# Altium schematic sheet 28Pins_Schematic.SchDoc (part 2 of 3)
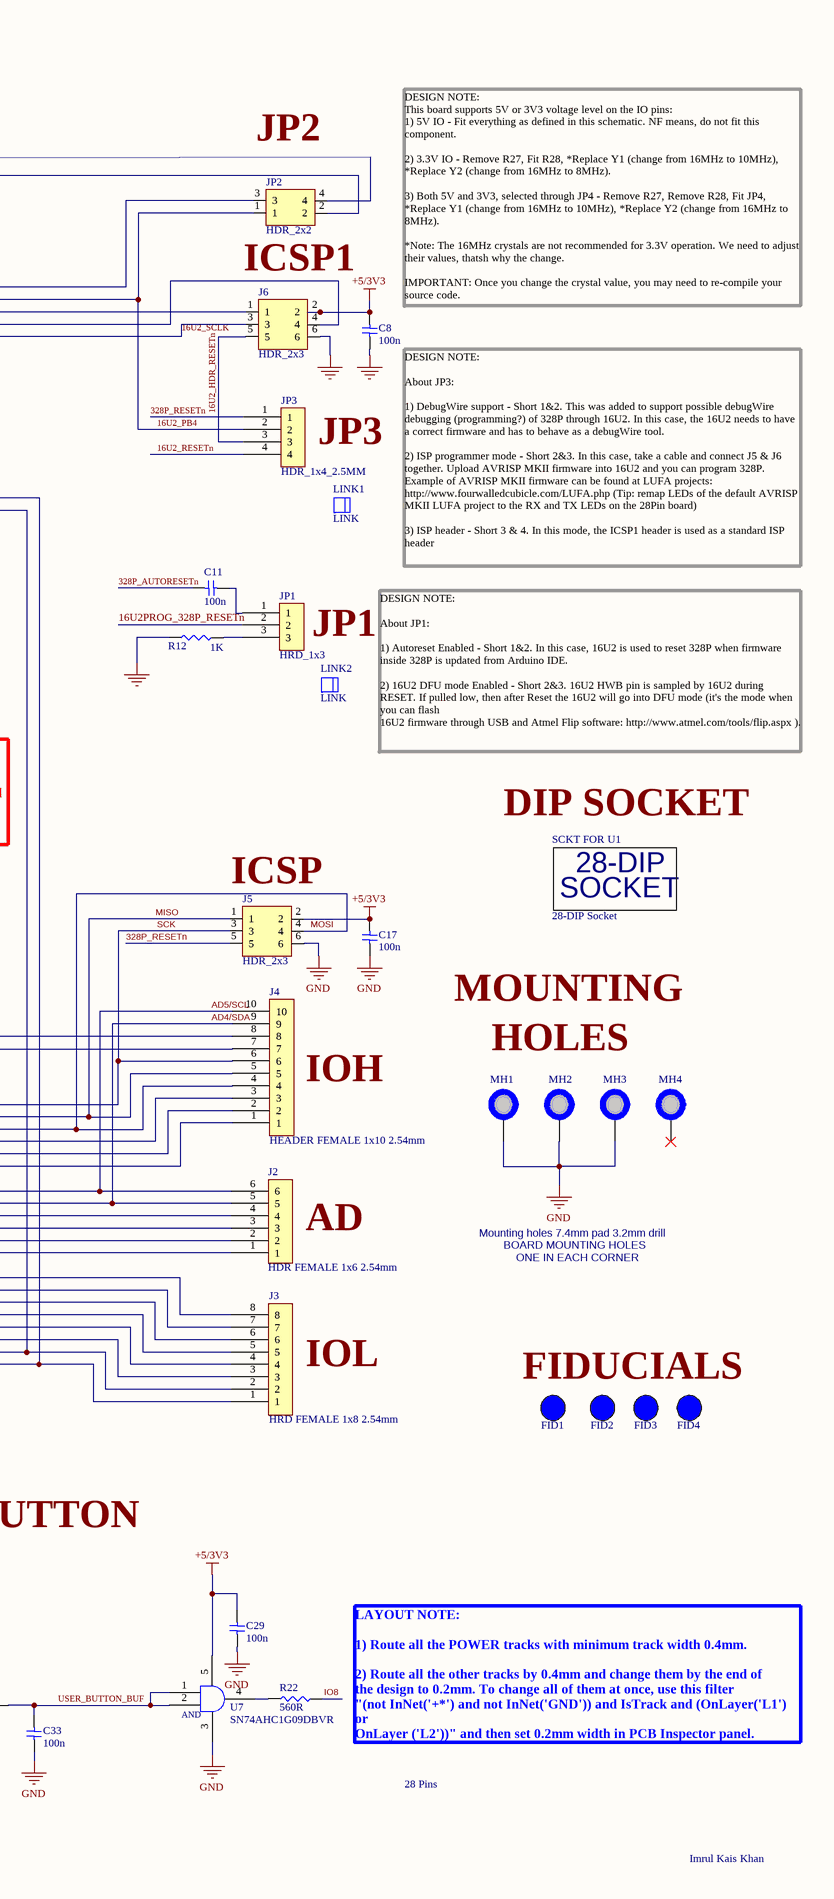
[diagram p2: 28Pins_Schematic.SchDoc, right]
## Library data of the parts
C1 C2 = EEE-1AA101WR: CAP ALUM 100UF 20% 10V SMD; Manufacturer: Panasonic; Ripple Current: 50mA; Life (Hours): 1000Hour; Supplier 1: Digi-Key; Manufacturer Part Number: EEE-1AA101WR; RoHS: Yes; Category: Aluminum Electrolytic Capacitors; Pricing 1: 1=0.42000, 10=0.29100, 50=0.20380, 100=0.17480, 500=0.13106 (USD); Mount: Surface Mount,PCB; Case/Package: Radial; Contact Plating: Tin; Min Operating Temperature: -40°C; Max Operating Temperature: 85°C; Capacitance: 100uF; Voltage Rating: 10V; Tolerance: 20%; Packaging: Tape and Reel; Package Quantity: 1000; Voltage Rating (DC): 10V; Termination: SMD/SMT; Ripple Current (AC): 50mA; Series: S; Construction: Cylindrical; Diameter: 5mm; Length: 5.5mm; Height: 5.4mm; Height - Seated (Max): 0.213inch; Ratings: AEC-Q200; Radiation Hardening: No; Lead Free: Lead Free; RoHS Compliant: Yes; ComponentLink1URL: https://datasheet.ciiva.com/26945/getdatasheetpartid-169213-26945071.pdf?src-supplier=Verical; ComponentLink1Description: https://datasheet.ciiva.com/26945/getdatasheetpartid-169213-26945071.pdf?src-supplier=Verical; ComponentLink2URL: https://datasheet.ciiva.com/24027/aba0000ce2-40801-24027541.pdf?src-supplier=Mouser; ComponentLink2Description: https://datasheet.ciiva.com/24027/aba0000ce2-40801-24027541.pdf?src-supplier=Mouser; ComponentLink3URL: https://datasheet.ciiva.com/14598/70255710-14598233.pdf?src-supplier=Allied+Electronics; ComponentLink3Description: https://datasheet.ciiva.com/14598/70255710-14598233.pdf?src-supplier=Allied+Electronics; ComponentLink4URL: https://datasheet.ciiva.com/14605/70255710-14605689.pdf?src-supplier=Allied+Electronics; ComponentLink4Description: https://datasheet.ciiva.com/14605/70255710-14605689.pdf?src-supplier=Allied+Electronics; ComponentLink5URL: https://datasheet.ciiva.com/11673/aba0000ce2-11673882.pdf?src-supplier=Avnet; ComponentLink5Description: https://datasheet.ciiva.com/11673/aba0000ce2-11673882.pdf?src-supplier=Avnet; ComponentLink6URL: https://datasheet.ciiva.com/16427/aba0000ce2-16427544.pdf?src-supplier=Future+Electronics; ComponentLink6Description: https://datasheet.ciiva.com/16427/aba0000ce2-16427544.pdf?src-supplier=Future+Electronics; ComponentLink7URL: https://datasheet.ciiva.com/2983/aba0000ce2-2983906.pdf?src-supplier=Avnet; ComponentLink7Description: https://datasheet.ciiva.com/2983/aba0000ce2-2983906.pdf?src-supplier=Avnet; ComponentLink8URL: https://datasheet.ciiva.com/30075/11aba0000ce2-30075303.pdf?src-supplier=Onlinecomponents.com; ComponentLink8Description: https://datasheet.ciiva.com/30075/11aba0000ce2-30075303.pdf?src-supplier=Onlinecomponents.com; Supplier Part Number 1: PCE3867CT-ND
C3 C12 C13 C19 C21 C22 C34 = C2012X5R1C106M085AC: TDK - C2012X5R1C106M085AC - SMD Multilayer Ceramic Capacitor, 10 µF, 16 V, 0805 [2012 Metric], ± 20%, X5R, C Series TDK; Capacitance: 10uF; Voltage Rating: 16V; Supplier 1: Arrow Electronics; Manufacturer: TDK; Manufacturer Part Number: C2012X5R1C106M085AC; RoHS: Yes; Category: Ceramic Capacitors; Stock 1: 888; Pricing 1: 1=0.26740, 10=0.11160, 25=0.11140, 50=0.10840, 100=0.08930, 250=0.08850, 500=0.05410 (USD); Mount: Surface Mount; Case/Package: 0805; Number of Pins: 2; Case Code (Metric): 2012; Case Code (Imperial): 0805; Weight: 0.000194oz; Dielectric Material: Ceramic; Min Operating Temperature: -55°C; Max Operating Temperature: 85°C; Packaging: Tape and Reel; Tolerance: 20%; Termination: SMD/SMT; Package Quantity: 4000; Voltage Rating (DC): 16V; Dielectric: X5R; Resistor Type: Ceramic; Series: C; Construction: Flat; Voltage: 16V; Length: 2mm; Width: 1.25mm; Height: 0.85mm; Thickness: 0.037inch; Depth: 1.25mm; RoHS Compliant: Yes; Lead Free: Lead Free; ComponentLink1URL: https://datasheet.ciiva.com/11788/0900766b80c1bb00-11788108.pdf?src-supplier=Rs; ComponentLink1Description: https://datasheet.ciiva.com/11788/0900766b80c1bb00-11788108.pdf?src-supplier=Rs; ComponentLink2URL: https://datasheet.ciiva.com/24218/c2012x5r1c106m085ac-265002-24218340.pdf?src-supplier=Mouser; ComponentLink2Description: https://datasheet.ciiva.com/24218/c2012x5r1c106m085ac-265002-24218340.pdf?src-supplier=Mouser; ComponentLink3URL: https://datasheet.ciiva.com/6290/tdkmlcccaprange-6290485.pdf?src-supplier=Digi-Key; ComponentLink3Description: https://datasheet.ciiva.com/6290/tdkmlcccaprange-6290485.pdf?src-supplier=Digi-Key; ComponentLink4URL: https://datasheet.ciiva.com/22725/1913358-22725557.pdf?src-supplier=Element14; ComponentLink4Description: https://datasheet.ciiva.com/22725/1913358-22725557.pdf?src-supplier=Element14; ComponentLink5URL: https://datasheet.ciiva.com/6290/tdkmlcccaprange-6290487.pdf?src-supplier=Digi-Key; ComponentLink5Description: https://datasheet.ciiva.com/6290/tdkmlcccaprange-6290487.pdf?src-supplier=Digi-Key; ComponentLink6URL: https://datasheet.ciiva.com/16449/e412-c-16449591.pdf?src-supplier=Future+Electronics; ComponentLink6Description: https://datasheet.ciiva.com/16449/e412-c-16449591.pdf?src-supplier=Future+Electronics; ComponentLink7URL: https://datasheet.ciiva.com/23803/1796654-23803021.pdf?src-supplier=Newark; ComponentLink7Description: https://datasheet.ciiva.com/23803/1796654-23803021.pdf?src-supplier=Newark; Supplier Part Number 1: C2012X5R1C106M085AC
C4-C6 C8 C11 C14-C17 C20 C23 C24 C26 C28-C33 = C2012X7R1H104K085AA (2): C Series 0805 0.1 uF 50 V ±10 % Tolerance X7R SMT Multilayer Ceramic Capacitor; Manufacturer: TDK; Capacitance: 100nF; Voltage Rating: 50V; Tolerance: 10%; Supplier 1: Digi-Key; RoHS: Yes; Category: Ceramic Capacitors; Stock 1: 1523417; Pricing 1: 1=0.13000, 10=0.09500, 50=0.05400, 100=0.04480, 500=0.03142, 1000=0.02601 (USD); Mount: Surface Mount; Case/Package: 0805; Number of Pins: 2; Case Code (Metric): 2012; Case Code (Imperial): 0805; Weight: 0.000194oz; Dielectric Material: Ceramic; Min Operating Temperature: -55°C; Max Operating Temperature: 125°C; Packaging: Tape and Reel; Voltage Rating (DC): 50V; Dielectric: X7R; Termination: SMD/SMT; Construction: Flat; Package Quantity: 1; Resistor Type: Ceramic; Voltage: 50V; Series: C; Length: 2mm; Width: 0.049inch; Height: 0.85mm; Depth: 1.25mm; Thickness: 0.037inch; Radiation Hardening: No; RoHS Compliant: Yes; Reach SVHC Compliant: Yes; Lead Free: Lead Free; ComponentLink1URL: https://datasheet.ciiva.com/11788/0900766b80c1bb00-11788128.pdf?src-supplier=Rs; ComponentLink1Description: https://datasheet.ciiva.com/11788/0900766b80c1bb00-11788128.pdf?src-supplier=Rs; ComponentLink2URL: https://datasheet.ciiva.com/6250/tdkmlcccaprange-6250821.pdf?src-supplier=Digi-Key; ComponentLink2Description: https://datasheet.ciiva.com/6250/tdkmlcccaprange-6250821.pdf?src-supplier=Digi-Key; ComponentLink3URL: https://datasheet.ciiva.com/24191/e412-c-24191447.pdf?src-supplier=Future+Electronics; ComponentLink3Description: https://datasheet.ciiva.com/24191/e412-c-24191447.pdf?src-supplier=Future+Electronics; ComponentLink4URL: https://datasheet.ciiva.com/6250/tdkmlcccaprange-6250824.pdf?src-supplier=Digi-Key; ComponentLink4Description: https://datasheet.ciiva.com/6250/tdkmlcccaprange-6250824.pdf?src-supplier=Digi-Key; ComponentLink5URL: https://datasheet.ciiva.com/23803/1796654-23803035.pdf?src-supplier=Newark; ComponentLink5Description: https://datasheet.ciiva.com/23803/1796654-23803035.pdf?src-supplier=Newark; ComponentLink6URL: https://datasheet.ciiva.com/28602/1571323-28602204.pdf?src-supplier=Element14; ComponentLink6Description: https://datasheet.ciiva.com/28602/1571323-28602204.pdf?src-supplier=Element14; Manufacturer Part Number: C2012X7R1H104K085AA; Supplier Part Number 1: 445-7534-1-ND
C7 = C2012X5R1E105K125AA: CAP CER 1UF 25V X5R 0805; Manufacturer: TDK; Dielectric Material: Ceramic; Tolerance: 10%; Supplier 1: Digi-Key; Manufacturer Part Number: C2012X5R1E105K125AA; RoHS: Yes; Category: Ceramic Capacitors; Stock 1: 51550; Pricing 1: 1=0.21000, 10=0.14500, 50=0.08720, 100=0.07370, 500=0.05042, 1000=0.04460 (USD); Mount: Surface Mount; Case/Package: 0805; Number of Pins: 2; Case Code (Metric): 2012; Case Code (Imperial): 0805; Weight: 0.000194oz; Min Operating Temperature: -55°C; Max Operating Temperature: 85°C; Capacitance: 1uF; Voltage Rating: 25V; Packaging: Tape and Reel; Voltage Rating (DC): 25V; Dielectric: X5R; Termination: SMD/SMT; Construction: Flat; Package Quantity: 2000; Resistor Type: Ceramic; Voltage: 25V; Series: C; Length: 2mm; Width: 0.049inch; Height: 1.25mm; Depth: 1.25mm; Thickness: 0.057inch; Radiation Hardening: No; Lead Free: Lead Free; RoHS Compliant: Yes; Reach SVHC Compliant: Yes; ComponentLink1URL: https://datasheet.ciiva.com/11787/0900766b80c1bb00-11787608.pdf?src-supplier=Rs; ComponentLink1Description: https://datasheet.ciiva.com/11787/0900766b80c1bb00-11787608.pdf?src-supplier=Rs; ComponentLink2URL: https://datasheet.ciiva.com/16449/e412-c-16449595.pdf?src-supplier=Future+Electronics; ComponentLink2Description: https://datasheet.ciiva.com/16449/e412-c-16449595.pdf?src-supplier=Future+Electronics; ComponentLink3URL: https://datasheet.ciiva.com/28602/1744655-28602171.pdf?src-supplier=Element14; ComponentLink3Description: https://datasheet.ciiva.com/28602/1744655-28602171.pdf?src-supplier=Element14; ComponentLink4URL: https://datasheet.ciiva.com/15192/getdatasheetpartid-726707-15192140.pdf?src-supplier=Verical; ComponentLink4Description: https://datasheet.ciiva.com/15192/getdatasheetpartid-726707-15192140.pdf?src-supplier=Verical; Supplier Part Number 1: 445-1419-1-ND
C9 C10 C25 C27 = C0805C180J5GACTU: Cap Ceramic 18pF 50V C0G 5% SMD 0805 125C Paper T/R; Manufacturer: KEMET; Temperature Coefficient: 30ppm/°C; Dissipation Factor: 0.1%; Supplier 1: Digi-Key; Manufacturer Part Number: C0805C180J5GACTU; RoHS: Yes; Category: Ceramic Capacitors; Stock 1: 36847; Pricing 1: 1=0.11000, 10=0.07900, 50=0.04500, 100=0.03730, 500=0.02618, 1000=0.02168 (USD); Mount: Surface Mount,PCB; Case/Package: 0805; Number of Pins: 2; Dielectric Material: Ceramic; Case Code (Imperial): 0805; Case Code (Metric): 2012; Contact Plating: Tin,Matte; Contact Material: Tin; Min Operating Temperature: -55°C; Max Operating Temperature: 125°C; Tolerance: 5%; Capacitance: 18pF; Dielectric: C0G; Packaging: Tape and Reel; Termination: SMD/SMT; Voltage Rating (DC): 50V; Package Quantity: 1; Series: C; Construction: Flat; Voltage: 50V; Voltage Rating: 50V; Length: 2mm; Width: 0.049inch; Height: 0.78mm; Depth: 1.25mm; Lead Pitch: 0.75mm; Thickness: 0.035inch; Radiation Hardening: No; Lead Free: Lead Free; RoHS Compliant: Yes; Reach SVHC Compliant: Yes; ComponentLink1URL: https://datasheet.ciiva.com/22746/1769375-22746770.pdf?src-supplier=Element14; ComponentLink1Description: https://datasheet.ciiva.com/22746/1769375-22746770.pdf?src-supplier=Element14; ComponentLink2URL: https://datasheet.ciiva.com/26923/getdatasheetpartid-759702-26923980.pdf?src-supplier=Verical; ComponentLink2Description: https://datasheet.ciiva.com/26923/getdatasheetpartid-759702-26923980.pdf?src-supplier=Verical; ComponentLink3URL: https://datasheet.ciiva.com/26847/getdatasheetpartid-385668-26847862.pdf?src-supplier=Verical; ComponentLink3Description: https://datasheet.ciiva.com/26847/getdatasheetpartid-385668-26847862.pdf?src-supplier=Verical; Supplier Part Number 1: 399-C0805C180J5GAC7800CT-ND
D1 = LGL29K-G2J1-24-Z: LED Single Chip Green 570nm 20mA 2-Pin 0603 T/R; Manufacturer: Osram Opto; Lens Color: White; Forward Voltage: 2.2V; Luminous Intensity: 5.6mcd; Viewing Angle: 160°; Lens Style: Flat,Diffused,Colorless,Rectangular; Test Current: 2mA; Luminous Flux: 0.012lm; Number of LEDs: 1; Reverse Voltage: 12V; Lens Transparency: Diffused; Lens Size: 0.8mm; Supplier 1: SHENGYU ELECTRONICS; Manufacturer Part Number: LGL29K-G2J1-24-Z; RoHS: Yes; Category: LEDs; Stock 1: 8400; Pricing 1: 5=0.07900, 10=0.07800, 100=0.08000, 1000=0.07000, 10000=0.07000 (USD); Mount: Surface Mount; Case/Package: 0603; Number of Pins: 2; Color: Green; Case Code (Metric): 1608; Case Code (Imperial): 0603; Min Operating Temperature: -40°C; Max Operating Temperature: 100°C; Packaging: Tape and Reel; Series: SmartLED; Forward Current: 20mA; Package Quantity: 5000; Dominant Wavelength: 570nm; Number of Elements: 1; Illumination Color: Green; Length: 1.3mm; Width: 0.8mm; Height: 0.65mm; Depth: 0.8mm; Radiation Hardening: No; RoHS Compliant: Yes; ComponentLink1URL: https://datasheet.ciiva.com/4689/g-l29k-39844-4689584.pdf?src-supplier=Mouser; ComponentLink1Description: https://datasheet.ciiva.com/4689/g-l29k-39844-4689584.pdf?src-supplier=Mouser; ComponentLink2URL: https://datasheet.ciiva.com/15198/getdatasheetpartid-571127-15198411.pdf?src-supplier=Verical; ComponentLink2Description: https://datasheet.ciiva.com/15198/getdatasheetpartid-571127-15198411.pdf?src-supplier=Verical; ComponentLink3URL: https://datasheet.ciiva.com/2112/00077107-0-2112887.pdf?src-supplier=Digi-Key; ComponentLink3Description: https://datasheet.ciiva.com/2112/00077107-0-2112887.pdf?src-supplier=Digi-Key; ComponentLink4URL: https://datasheet.ciiva.com/2112/00077107-0-2112886.pdf?src-supplier=Digi-Key; ComponentLink4Description: https://datasheet.ciiva.com/2112/00077107-0-2112886.pdf?src-supplier=Digi-Key; ComponentLink5URL: https://datasheet.ciiva.com/2112/00077107-0-2112888.pdf?src-supplier=Digi-Key; ComponentLink5Description: https://datasheet.ciiva.com/2112/00077107-0-2112888.pdf?src-supplier=Digi-Key; Supplier Part Number 1: LGL29K-G2J1-24-Z
D2-D4 = LOL29K-H2K1-24: LED Uni-Color Orange 610nm 2-Pin Case 0603 T/R; Manufacturer: Osram Opto; Lens Color: Clear; Luminous Intensity: 9mcd; Forward Voltage: 2.2V; Forward Current: 20mA; Viewing Angle: 160°; Lens Style: Diffused,Colorless; Luminous Flux: 0.025lm; Dominant Wavelength: 606nm; Test Current: 2mA; Number of Elements: 1; Reverse Voltage: 12V; Supplier 1: Mouser; Manufacturer Part Number: LOL29K-H2K1-24; RoHS: Yes; Category: LEDs; Stock 1: 21307; Pricing 1: 1=0.46000, 10=0.31000, 50=0.31000, 100=0.20700, 1000=0.12000, 10000=0.09200 (USD); Mount: Surface Mount; Case/Package: 1608; Number of Pins: 2; Color: Orange; Min Operating Temperature: -40°C; Max Operating Temperature: 100°C; Packaging: Tape and Reel; Number of LEDs: 1; Series: SmartLED; Length: 1.3mm; Depth: 0.8mm; RoHS Compliant: Yes; ComponentLink1URL: https://datasheet.ciiva.com/11775/0900766b80d1573e-11775188.pdf?src-supplier=Rs; ComponentLink1Description: https://datasheet.ciiva.com/11775/0900766b80d1573e-11775188.pdf?src-supplier=Rs; Supplier Part Number 1: 720-LOL29KH2K124Z
D5 D6 = BAT54HT1G: VR=30V IF=200mA 10pF P=200mW; Manufacturer: ON Semiconductor / Fairchild; Forward Voltage: 800mV; Forward Current: 200mA; Recovery Time: 5ns; Max Repetitive Reverse Voltage (Vrrm): 30V; Peak Non-Repetitive Surge Current: 600mA; Element Configuration: Single; Max Reverse Current: 2uA; Power Dissipation: 200mW; Polarity: Standard; Supplier 1: Digi-Key; Manufacturer Part Number: BAT54HT1G; RoHS: Yes; Category: Schottky Diodes; Stock 1: 64443; Pricing 1: 1=0.24000, 10=0.19900, 100=0.10570, 500=0.06956, 1000=0.04730 (USD); Mount: Surface Mount; Number of Pins: 2; Contact Plating: Tin,Matte; Min Operating Temperature: -55°C; Max Operating Temperature: 150°C; Packaging: Tape and Reel; Package Quantity: 1; Average Rectified Current: 200mA; Reverse Recovery Time: 5ns; Max Forward Surge Current (Ifsm): 600mA; Max Reverse Voltage (DC): 30V; Series: -; Max Surge Current: 600mA; Voltage Rating (DC): 30V; Current Rating: 200mA; Capacitance: 10pF; Output Current: 200mA; Reverse Voltage: 30V; Max Reverse Leakage Current: 2uA; Reverse Recovery Time-Max: 5ns; Length: 1.8mm; Width: 1.35mm; Height: 1mm; Radiation Hardening: No; Lead Free: Lead Free; RoHS Compliant: Yes; Reach SVHC Compliant: Yes; ComponentLink1URL: https://datasheet.ciiva.com/30479/0900766b811a63a9-30479442.pdf?src-supplier=Rs; ComponentLink1Description: https://datasheet.ciiva.com/30479/0900766b811a63a9-30479442.pdf?src-supplier=Rs; ComponentLink2URL: https://datasheet.ciiva.com/1240/1747983-1240762.pdf?src-supplier=Newark; ComponentLink2Description: https://datasheet.ciiva.com/1240/1747983-1240762.pdf?src-supplier=Newark; ComponentLink3URL: https://datasheet.ciiva.com/34301/806549-34301562.pdf?src-supplier=Jameco; ComponentLink3Description: https://datasheet.ciiva.com/34301/806549-34301562.pdf?src-supplier=Jameco; ComponentLink4URL: https://datasheet.ciiva.com/4452/bat54ht1g-104602-4452889.pdf?src-supplier=Mouser; ComponentLink4Description: https://datasheet.ciiva.com/4452/bat54ht1g-104602-4452889.pdf?src-supplier=Mouser; ComponentLink5URL: https://datasheet.ciiva.com/4714/bat54ht1-d-72881-4714706.pdf?src-supplier=Mouser; ComponentLink5Description: https://datasheet.ciiva.com/4714/bat54ht1-d-72881-4714706.pdf?src-supplier=Mouser; ComponentLink6URL: https://datasheet.ciiva.com/1180/bat54ht1-d-1180252.pdf?src-supplier=Element14; ComponentLink6Description: https://datasheet.ciiva.com/1180/bat54ht1-d-1180252.pdf?src-supplier=Element14; ComponentLink7URL: https://datasheet.ciiva.com/1180/bat54ht1-d-1180251.pdf?src-supplier=Element14; ComponentLink7Description: https://datasheet.ciiva.com/1180/bat54ht1-d-1180251.pdf?src-supplier=Element14; ComponentLink8URL: https://datasheet.ciiva.com/915/bat54ht1-d-915443.pdf?src-supplier=Digi-Key; ComponentLink8Description: https://datasheet.ciiva.com/915/bat54ht1-d-915443.pdf?src-supplier=Digi-Key; ComponentLink9URL: https://datasheet.ciiva.com/8303/bat54ht1g-8303645.pdf?src-supplier=Avnet; ComponentLink9Description: https://datasheet.ciiva.com/8303/bat54ht1g-8303645.pdf?src-supplier=Avnet; ComponentLink10URL: https://datasheet.ciiva.com/17020/bat54ht1g-17020445.pdf?src-supplier=Future+Electronics; ComponentLink10Description: https://datasheet.ciiva.com/17020/bat54ht1g-17020445.pdf?src-supplier=Future+Electronics; ComponentLink11URL: https://datasheet.ciiva.com/8294/bat54ht1-d-8294645.pdf?src-supplier=Avnet; ComponentLink11Description: https://datasheet.ciiva.com/8294/bat54ht1-d-8294645.pdf?src-supplier=Avnet; ComponentLink12URL: https://datasheet.ciiva.com/910/bat54ht1g-910498.pdf?src-supplier=Digi-Key; ComponentLink12Description: https://datasheet.ciiva.com/910/bat54ht1g-910498.pdf?src-supplier=Digi-Key; ComponentLink13URL: https://datasheet.ciiva.com/910/bat54ht1g-910499.pdf?src-supplier=Digi-Key; ComponentLink13Description: https://datasheet.ciiva.com/910/bat54ht1g-910499.pdf?src-supplier=Digi-Key; ComponentLink14URL: https://datasheet.ciiva.com/915/bat54ht1-d-915444.pdf?src-supplier=Digi-Key; ComponentLink14Description: https://datasheet.ciiva.com/915/bat54ht1-d-915444.pdf?src-supplier=Digi-Key; ComponentLink15URL: https://datasheet.ciiva.com/915/bat54ht1-d-915445.pdf?src-supplier=Digi-Key; ComponentLink15Description: https://datasheet.ciiva.com/915/bat54ht1-d-915445.pdf?src-supplier=Digi-Key; ComponentLink16URL: https://datasheet.ciiva.com/46429/1727620-46429206.pdf?src-supplier=Element14; ComponentLink16Description: https://datasheet.ciiva.com/46429/1727620-46429206.pdf?src-supplier=Element14; ComponentLink17URL: https://datasheet.ciiva.com/910/bat54ht1g-910497.pdf?src-supplier=Digi-Key; ComponentLink17Description: https://datasheet.ciiva.com/910/bat54ht1g-910497.pdf?src-supplier=Digi-Key; ComponentLink18URL: https://datasheet.ciiva.com/48686/001262925-da-01-en-diode-schottky-30v-bat54ht1g-sod-323-fsc-48686266.pdf?src-supplier=Conrad; ComponentLink18Description: https://datasheet.ciiva.com/48686/001262925-da-01-en-diode-schottky-30v-bat54ht1g-sod-323-fsc-48686266.pdf?src-supplier=Conrad; Supplier Part Number 1: BAT54HT1GOSCT-ND
FB1-FB3 = MPZ2012S601AT000: 0805 600Ω ±25% DCR=0.1Ω 2A; Manufacturer: TDK; Impedance: 600R; DC Resistance (DCR): 100mR; Number of Lines: 1; Supplier 1: Newark; Manufacturer Part Number: MPZ2012S601AT000; RoHS: Yes; Category: Ferrite Beads and Chips; Stock 1: 12934; Pricing 1: 1=0.13000, 25=0.10100, 50=0.07400, 100=0.04600 (USD); Mount: Surface Mount; Case/Package: 0805; Case Code (Metric): 2012; Case Code (Imperial): 0805; Min Operating Temperature: -55°C; Max Operating Temperature: 125°C; Packaging: Tape and Reel; Package Quantity: 1; Current Rating: 2A; Max DC Current: 2A; Series: MPZ; Max Current Rating: 2A; Length: 0.079inch; Width: 0.049inch; Height: 0.041inch; Reach SVHC Compliant: Yes; Lead Free: Lead Free; RoHS Compliant: Yes; ComponentLink1URL: https://datasheet.ciiva.com/46634/beads-commercial-power-mpz-en-46634335.pdf?src-supplier=Digi-Key; ComponentLink1Description: https://datasheet.ciiva.com/46634/beads-commercial-power-mpz-en-46634335.pdf?src-supplier=Digi-Key; ComponentLink2URL: https://datasheet.ciiva.com/46634/beads-commercial-power-mpz-en-46634377.pdf?src-supplier=Digi-Key; ComponentLink2Description: https://datasheet.ciiva.com/46634/beads-commercial-power-mpz-en-46634377.pdf?src-supplier=Digi-Key; ComponentLink3URL: https://datasheet.ciiva.com/46634/beads-commercial-power-mpz-en-46634606.pdf?src-supplier=Digi-Key; ComponentLink3Description: https://datasheet.ciiva.com/46634/beads-commercial-power-mpz-en-46634606.pdf?src-supplier=Digi-Key; Supplier Part Number 1: 89R3160
FID1-FID4 = FID_1MMC: Fiducial 40mil Diameter, 120mil Mask
J1 J3 = M20-7820842: 2.54mm (0.1") Pitch SIL Vertical PC Tail Socket Assembly, selective gold + tin, 8 contacts; Manufacturer: Harwin; Number of Contacts: 8; Connector Type: Receptacle,Socket; Max Current Rating: 3A; Contact Resistance: 20mR; Supplier 1: Digi-Key; Manufacturer Part Number: M20-7820842; RoHS: Yes; Category: Headers and Wire Housings; Stock 1: 1355; Pricing 1: 1=1.10000, 10=0.97200, 100=0.83820, 500=0.68580, 1000=0.60960, 5000=0.53340, 10000=0.50673 (USD); Mount: Through Hole; Case/Package: SIL; Weight: 0.025397oz; Contact Plating: Tin,Gold; Housing Color: Black; Color: Black; Contact Material: Bronze; Housing Material: Polyamide; Min Operating Temperature: -40°C; Max Operating Temperature: 105°C; Termination: Solder; Number of Rows: 1; Orientation: Straight; Number of Positions: 8; Gender: Female; Contact Gender: Female; Package Quantity: 29; Packaging: Rail/Tube; Length: 20.72mm; Pitch: 2.54mm; Depth: 2.5mm; Radiation Hardening: No; ComponentLink1URL: https://datasheet.ciiva.com/16732/m20-782-16732663.pdf?src-supplier=Avnet+Europe; ComponentLink1Description: https://datasheet.ciiva.com/16732/m20-782-16732663.pdf?src-supplier=Avnet+Europe; ComponentLink2URL: https://datasheet.ciiva.com/9480/m20-782-9480074.pdf?src-supplier=Avnet; ComponentLink2Description: https://datasheet.ciiva.com/9480/m20-782-9480074.pdf?src-supplier=Avnet; Supplier Part Number 1: 952-1823-ND
J2 = M20-7820646: 06-WAY SIL VERT SOCKET L/FREE; Manufacturer: Harwin; Number of Contacts: 6; Connector Type: Receptacle,Socket; Max Current Rating: 3A; Contact Resistance: 20mR; Supplier 1: Digi-Key; Manufacturer Part Number: M20-7820646; RoHS: Yes; Category: Headers and Wire Housings; Stock 1: 2220; Pricing 1: 1=0.96000, 10=0.84200, 100=0.72600, 500=0.59400, 1000=0.52800, 5000=0.46200, 10000=0.43890 (USD); Mount: Through Hole; Case/Package: SIL; Housing Material: Nylon; Color: Black; Contact Plating: Tin; Contact Material: Bronze; Housing Color: Black; Min Operating Temperature: -40°C; Max Operating Temperature: 105°C; Termination: Solder; Number of Rows: 1; Gender: Female; Number of Positions: 6; Packaging: Rail/Tube; Orientation: Straight; Contact Gender: Female; Package Quantity: 38; Length: 15.64mm; Pitch: 2.54mm; Depth: 2.5mm; Radiation Hardening: No; ComponentLink1URL: http://components.arrow.com/part/dataview/0323_00725884?src-supplier=Arrow+Europe; ComponentLink1Description: http://components.arrow.com/part/dataview/0323_00725884?src-supplier=Arrow+Europe; ComponentLink2URL: http://www.harwin.com/include/downloads/pdfs/2010PAGE120.PDF?src-supplier=Avnet; ComponentLink2Description: http://www.harwin.com/include/downloads/pdfs/2010PAGE120.PDF?src-supplier=Avnet; ComponentLink3URL: https://cdn.harwin.com/pdfs/M20-782.pdf?src-supplier=Digi-Key; ComponentLink3Description: https://cdn.harwin.com/pdfs/M20-782.pdf?src-supplier=Digi-Key; ComponentLink4URL: https://cdn.harwin.com/pdfs/Harwin_PC_Connectors_M20.pdf?src-supplier=Avnet+Europe; ComponentLink4Description: https://cdn.harwin.com/pdfs/Harwin_PC_Connectors_M20.pdf?src-supplier=Avnet+Europe; ComponentLink5URL: https://cdn.harwin.com/pdfs/Harwin_PC_Connectors_M20.pdf?src-supplier=RSComponents; ComponentLink5Description: https://cdn.harwin.com/pdfs/Harwin_PC_Connectors_M20.pdf?src-supplier=RSComponents; ComponentLink6URL: https://cdn.harwin.com/pdfs/Harwin_PC_Connectors_M20.pdf?src-supplier=Mouser; ComponentLink6Description: https://cdn.harwin.com/pdfs/Harwin_PC_Connectors_M20.pdf?src-supplier=Mouser; ComponentLink7URL: https://cdn.harwin.com/pdfs/Harwin_PC_Connectors_M20.pdf?src-supplier=TTI; ComponentLink7Description: https://cdn.harwin.com/pdfs/Harwin_PC_Connectors_M20.pdf?src-supplier=TTI; Supplier Part Number 1: 952-1809-ND
J4 = M20-7821046: HARWIN - M20-7821046 - Board-To-Board Connector, M20 Series, Through Hole, Receptacle, 10, 2.54 mm, Tin Plated Contacts; Connector Type: Receptacle,Socket; Number of Positions: 10; Insulation Resistance: 1MR; Max Current Rating: 3A; Contact Resistance: 20mR; Mating Cycles: 50; Hole Diameter: 0.8mm; Supplier 1: Digi-Key; Manufacturer: Harwin; Manufacturer Part Number: M20-7821046; RoHS: Yes; Category: Headers and Wire Housings; Stock 1: 530; Pricing 1: 1=1.28000, 10=1.12200, 100=0.96800, 500=0.79200, 1000=0.70400, 5000=0.61600, 10000=0.58520 (USD); Mount: Through Hole; Case/Package: SIL; Housing Color: Black; Color: Black; Contact Plating: Tin; Contact Material: Bronze; Housing Material: Polyamide; Min Operating Temperature: -40°C; Max Operating Temperature: 105°C; Orientation: Straight; Termination: Solder; Number of Contacts: 10; Gender: Receptacle; Packaging: Rail/Tube; Number of Rows: 1; Contact Gender: Female; Package Quantity: 23; Current Rating: 3A; Length: 25.8mm; Pitch: 2.54mm; Depth: 2.5mm; Lead Pitch: 2.54mm; Radiation Hardening: No; REACH SVHC: No SVHC; ComponentLink1URL: https://datasheet.ciiva.com/26899/getdatasheetpartid-559226-26899379.pdf?src-supplier=Verical; ComponentLink1Description: https://datasheet.ciiva.com/26899/getdatasheetpartid-559226-26899379.pdf?src-supplier=Verical; ComponentLink2URL: https://datasheet.ciiva.com/11753/0900766b80dc1d2b-11753869.pdf?src-supplier=RSComponents; ComponentLink2Description: https://datasheet.ciiva.com/11753/0900766b80dc1d2b-11753869.pdf?src-supplier=RSComponents; ComponentLink3URL: https://datasheet.ciiva.com/6785/m20-782-6785605.pdf?src-supplier=Digi-Key; ComponentLink3Description: https://datasheet.ciiva.com/6785/m20-782-6785605.pdf?src-supplier=Digi-Key; ComponentLink4URL: https://datasheet.ciiva.com/10151/m20-782-10151366.pdf?src-supplier=Avnet; ComponentLink4Description: https://datasheet.ciiva.com/10151/m20-782-10151366.pdf?src-supplier=Avnet; ComponentLink5URL: https://datasheet.ciiva.com/16732/m20-782-16732152.pdf?src-supplier=Avnet+Europe; ComponentLink5Description: https://datasheet.ciiva.com/16732/m20-782-16732152.pdf?src-supplier=Avnet+Europe; Supplier Part Number 1: 952-1847-ND
J5 J6 = 67997-106HLF: Conn Unshrouded Header HDR 6 POS 2.54mm Solder ST Top Entry Thru-Hole BergStik® Bulk; Manufacturer: Amphenol ICC / FCI; Supplier 1: Mouser; Manufacturer Part Number: 67997-106HLF; RoHS: No; Category: Headers and Wire Housings; Stock 1: 1180; Pricing 1: 1=2.25000, 10=2.14000, 50=2.14000, 100=1.98000, 1000=1.41000, 10000=1.20000 (USD); ComponentLink1URL: http://uk.rs-online.com/webdocs/1450/0900766b81450b8b.pdf?src-supplier=Rs; ComponentLink1Description: http://uk.rs-online.com/webdocs/1450/0900766b81450b8b.pdf?src-supplier=Rs; ComponentLink2URL: https://cdn.amphenol-icc.com/media/wysiwyg/files/drawing/67996.pdf?src-supplier=Onlinecomponents.com; ComponentLink2Description: https://cdn.amphenol-icc.com/media/wysiwyg/files/drawing/67996.pdf?src-supplier=Onlinecomponents.com; ComponentLink3URL: https://cdn.amphenol-icc.com/media/wysiwyg/files/drawing/67996.pdf?src-supplier=Digi-Key; ComponentLink3Description: https://cdn.amphenol-icc.com/media/wysiwyg/files/drawing/67996.pdf?src-supplier=Digi-Key; ComponentLink4URL: http://components.arrow.com/part/dataview/41913658S7633350N8314?src-supplier=Arrow+Electronics; ComponentLink4Description: http://components.arrow.com/part/dataview/41913658S7633350N8314?src-supplier=Arrow+Electronics; ComponentLink5URL: http://www.farnell.com/datasheets/1876884.pdf?src-supplier=Newark; ComponentLink5Description: http://www.farnell.com/datasheets/1876884.pdf?src-supplier=Newark; ComponentLink6URL: https://cdn.amphenol-icc.com/media/wysiwyg/files/drawing/67996.pdf?src-supplier=Allied+Electronics; ComponentLink6Description: https://cdn.amphenol-icc.com/media/wysiwyg/files/drawing/67996.pdf?src-supplier=Allied+Electronics; ComponentLink7URL: https://cdn.amphenol-icc.com/media/wysiwyg/files/drawing/67996.pdf?src-supplier=Mouser; ComponentLink7Description: https://cdn.amphenol-icc.com/media/wysiwyg/files/drawing/67996.pdf?src-supplier=Mouser; ComponentLink8URL: http://www.farnell.com/datasheets/1876884.pdf?src-supplier=Farnell; ComponentLink8Description: http://www.farnell.com/datasheets/1876884.pdf?src-supplier=Farnell; ComponentLink9URL: https://cdn.amphenol-icc.com/media/wysiwyg/files/drawing/67996.pdf?src-supplier=Avnet; ComponentLink9Description: https://cdn.amphenol-icc.com/media/wysiwyg/files/drawing/67996.pdf?src-supplier=Avnet; ComponentLink10URL: https://cdn.amphenol-icc.com/media/wysiwyg/files/drawing/67996.pdf?src-supplier=TTI; ComponentLink10Description: https://cdn.amphenol-icc.com/media/wysiwyg/files/drawing/67996.pdf?src-supplier=TTI; ComponentLink11URL: https://cdn.amphenol-icc.com/media/wysiwyg/files/drawing/67996.pdf?src-supplier=Heilind+Electronics; ComponentLink11Description: https://cdn.amphenol-icc.com/media/wysiwyg/files/drawing/67996.pdf?src-supplier=Heilind+Electronics; Supplier Part Number 1: 649-67997-106HLF
J7 = 10118193-0001LF: FCI Right Angle Surface Mount Mount Female USB Connector; 100 V ac; 1.8A; Manufacturer: Amphenol ICC / FCI; Supplier 1: LCSC; Manufacturer Part Number: 10118193-0001LF; RoHS: No; Category: USB Connectors; Stock 1: 268; Pricing 1: 1=0.21760, 10=0.17060, 30=0.14770, 100=0.12730, 500=0.12170, 1200=0.11830 (USD); ComponentLink1URL: http://uk.rs-online.com/webdocs/1450/0900766b814507f1.pdf?src-supplier=Rs; ComponentLink1Description: http://uk.rs-online.com/webdocs/1450/0900766b814507f1.pdf?src-supplier=Rs; ComponentLink2URL: http://www.amphenol-icc.com/media/wysiwyg/files/drawing/10118193.pdf?src-supplier=Digi-Key; ComponentLink2Description: http://www.amphenol-icc.com/media/wysiwyg/files/drawing/10118193.pdf?src-supplier=Digi-Key; ComponentLink3URL: https://cdn.amphenol-icc.com/media/wysiwyg/files/documentation/datasheet/inputoutput/io_usb_micro.pdf?src-supplier=Digi-Key; ComponentLink3Description: https://cdn.amphenol-icc.com/media/wysiwyg/files/documentation/datasheet/inputoutput/io_usb_micro.pdf?src-supplier=Digi-Key; ComponentLink4URL: https://cdn.amphenol-icc.com/media/wysiwyg/files/documentation/datasheet/inputoutput/io_usb_micro.pdf?src-supplier=Onlinecomponents.com; ComponentLink4Description: https://cdn.amphenol-icc.com/media/wysiwyg/files/documentation/datasheet/inputoutput/io_usb_micro.pdf?src-supplier=Onlinecomponents.com; ComponentLink5URL: https://cdn.amphenol-icc.com/media/wysiwyg/files/documentation/datasheet/inputoutput/io_usb_micro.pdf?src-supplier=Verical; ComponentLink5Description: https://cdn.amphenol-icc.com/media/wysiwyg/files/documentation/datasheet/inputoutput/io_usb_micro.pdf?src-supplier=Verical; ComponentLink6URL: https://cdn.amphenol-icc.com/media/wysiwyg/files/documentation/datasheet/inputoutput/io_usb_micro.pdf?src-supplier=Allied+Electronics; ComponentLink6Description: https://cdn.amphenol-icc.com/media/wysiwyg/files/documentation/datasheet/inputoutput/io_usb_micro.pdf?src-supplier=Allied+Electronics; ComponentLink7URL: https://cdn.amphenol-icc.com/media/wysiwyg/files/documentation/datasheet/inputoutput/io_usb_micro.pdf?src-supplier=Mouser; ComponentLink7Description: https://cdn.amphenol-icc.com/media/wysiwyg/files/documentation/datasheet/inputoutput/io_usb_micro.pdf?src-supplier=Mouser; ComponentLink8URL: https://cdn.amphenol-icc.com/media/wysiwyg/files/documentation/datasheet/inputoutput/io_usb_micro.pdf?src-supplier=Avnet; ComponentLink8Description: https://cdn.amphenol-icc.com/media/wysiwyg/files/documentation/datasheet/inputoutput/io_usb_micro.pdf?src-supplier=Avnet; ComponentLink9URL: https://cdn.amphenol-icc.com/media/wysiwyg/files/documentation/datasheet/inputoutput/io_usb_micro.pdf?src-supplier=Arrow+Electronics; ComponentLink9Description: https://cdn.amphenol-icc.com/media/wysiwyg/files/documentation/datasheet/inputoutput/io_usb_micro.pdf?src-supplier=Arrow+Electronics; ComponentLink10URL: https://cdn.amphenol-icc.com/media/wysiwyg/files/documentation/datasheet/inputoutput/io_usb_micro.pdf?src-supplier=Rs; ComponentLink10Description: https://cdn.amphenol-icc.com/media/wysiwyg/files/documentation/datasheet/inputoutput/io_usb_micro.pdf?src-supplier=Rs; ComponentLink11URL: https://cdn.amphenol-icc.com/media/wysiwyg/files/documentation/datasheet/inputoutput/io_usb_micro.pdf?src-supplier=TTI; ComponentLink11Description: https://cdn.amphenol-icc.com/media/wysiwyg/files/documentation/datasheet/inputoutput/io_usb_micro.pdf?src-supplier=TTI; ComponentLink12URL: https://cdn.amphenol-icc.com/media/wysiwyg/files/documentation/datasheet/inputoutput/io_usb_micro.pdf?src-supplier=TME; ComponentLink12Description: https://cdn.amphenol-icc.com/media/wysiwyg/files/documentation/datasheet/inputoutput/io_usb_micro.pdf?src-supplier=TME; ComponentLink13URL: https://cdn.amphenol-icc.com/media/wysiwyg/files/documentation/datasheet/inputoutput/io_usb_micro.pdf?src-supplier=Heilind+Electronics; ComponentLink13Description: https://cdn.amphenol-icc.com/media/wysiwyg/files/documentation/datasheet/inputoutput/io_usb_micro.pdf?src-supplier=Heilind+Electronics; Supplier Part Number 1: C132562
J8 J9 = PAD_WITH_HOLE_4MMx1.5MM: Pad with a Hole 4mm X 1.5mm
JP1 JP4 = 68000-103HLF: Conn Unshrouded Header HDR 3 POS 2.54mm Solder ST Top Entry Thru-Hole BergStik® Automotive Bulk; Manufacturer: Amphenol ICC / FCI; Supplier 1: Avnet; Manufacturer Part Number: 68000-103HLF; RoHS: No; Category: Headers and Wire Housings; Stock 1: 5922; Pricing 1: 1=0.40100, 10=0.28000, 25=0.27600, 50=0.27400, 100=0.27000, 250=0.25200, 500=0.23400 (USD); ComponentLink1URL: https://datasheet.ciiva.com/46392/1914865-46392021.pdf?src-supplier=Element14; ComponentLink1Description: https://datasheet.ciiva.com/46392/1914865-46392021.pdf?src-supplier=Element14; Supplier Part Number 1: 88K1775
JP2 = 68602-204HLF: Conn Unshrouded Header HDR 4 POS 2.54mm Solder ST Top Entry Thru-Hole BergStik® Bulk; Manufacturer: Amphenol ICC / FCI; Supplier 1: Avnet; Manufacturer Part Number: 68602-204HLF; RoHS: No; Category: Connectors; Stock 1: 10; Pricing 1: 1=0.36700, 10=0.24900, 25=0.23400, 50=0.22000, 100=0.20500, 250=0.19300 (USD); ComponentLink1URL: https://cdn.amphenol-icc.com/media/wysiwyg/files/drawing/67996.pdf?src-supplier=Digi-Key; ComponentLink1Description: https://cdn.amphenol-icc.com/media/wysiwyg/files/drawing/67996.pdf?src-supplier=Digi-Key; ComponentLink2URL: https://cdn.amphenol-icc.com/media/wysiwyg/files/drawing/67996.pdf?src-supplier=Allied+Electronics; ComponentLink2Description: https://cdn.amphenol-icc.com/media/wysiwyg/files/drawing/67996.pdf?src-supplier=Allied+Electronics; ComponentLink3URL: https://cdn.amphenol-icc.com/media/wysiwyg/files/drawing/67996.pdf?src-supplier=Mouser; ComponentLink3Description: https://cdn.amphenol-icc.com/media/wysiwyg/files/drawing/67996.pdf?src-supplier=Mouser; ComponentLink4URL: https://cdn.amphenol-icc.com/media/wysiwyg/files/drawing/67996.pdf?src-supplier=Avnet; ComponentLink4Description: https://cdn.amphenol-icc.com/media/wysiwyg/files/drawing/67996.pdf?src-supplier=Avnet; ComponentLink5URL: https://cdn.amphenol-icc.com/media/wysiwyg/files/drawing/67996.pdf?src-supplier=Heilind+Electronics; ComponentLink5Description: https://cdn.amphenol-icc.com/media/wysiwyg/files/drawing/67996.pdf?src-supplier=Heilind+Electronics; Supplier Part Number 1: 28AH8858
JP3 = 68001-204HLF: Conn Unshrouded Header HDR 4 POS 2.54mm Solder ST Thru-Hole Bag; Manufacturer: Amphenol ICC; Supplier 1: Digi-Key; Manufacturer Part Number: 68001-204HLF; RoHS: Yes; Category: Uncategorized; Stock 1: 8220; Pricing 1: 1=0.480000, 10=0.407000, 100=0.316200, 500=0.271060, 1000=0.225890, 5000=0.193620, 10000=0.180710 (USD); ComponentLink1URL: http://www.farnell.com/cad/2615197.pdf?src-supplier=Farnell; ComponentLink1Description: http://www.farnell.com/cad/2615197.pdf?src-supplier=Farnell; ComponentLink2URL: http://www.farnell.com/cad/2615197.pdf?src-supplier=Newark; ComponentLink2Description: http://www.farnell.com/cad/2615197.pdf?src-supplier=Newark; Supplier Part Number 1: 609-3402-ND
L1 = L1210R2R2MDWIT: Inductor RF Chip Wirewound 2.2uH 20% 100KHz 1.13A 0.104Ohm DCR 1210 T/R; Manufacturer: KEMET; Core Material: Ferrite; Shielding: Unshielded; Self Resonant Frequency: 190MHz; DC Resistance (DCR): 80mR; Supplier 1: Digi-Key; Manufacturer Part Number: L1210R2R2MDWIT; RoHS: Yes; Category: Fixed Inductors; Pricing 1: 1=0.48000, 10=0.42100, 25=0.39080, 50=0.33060, 100=0.30050, 250=0.28244, 500=0.25240 (USD); Mount: Surface Mount; Case/Package: 1210; Case Code (Metric): 3225; Case Code (Imperial): 1210; Min Operating Temperature: -40°C; Max Operating Temperature: 105°C; Tolerance: 20%; Inductance: 2.2uH; Max DC Current: 2A; Package Quantity: 1000; Current Rating: 2A; Packaging: Tape and Reel; Inductance Tolerance: 20%; Resistor Type: Wirewound,Ceramic; Test Frequency: 100kHz; Termination: SMD/SMT; DC Current: 1.13A; Series: L-DWI; Length: 3.2mm; Width: 2.5mm; Height: 2.5mm; Height - Seated (Max): 0.106inch; Depth: 2.7mm; Radiation Hardening: No; Reach SVHC Compliant: Yes; Military Standard: Not; RoHS Compliant: Yes; ComponentLink1URL: https://datasheet.ciiva.com/4957/f3115-4957838.pdf?src-supplier=Mouser; ComponentLink1Description: https://datasheet.ciiva.com/4957/f3115-4957838.pdf?src-supplier=Mouser; ComponentLink2URL: https://datasheet.ciiva.com/6691/f3115-6691487.pdf?src-supplier=Digi-Key; ComponentLink2Description: https://datasheet.ciiva.com/6691/f3115-6691487.pdf?src-supplier=Digi-Key; ComponentLink3URL: https://datasheet.ciiva.com/8512/f3115-8512543.pdf?src-supplier=Avnet; ComponentLink3Description: https://datasheet.ciiva.com/8512/f3115-8512543.pdf?src-supplier=Avnet; ComponentLink4URL: https://datasheet.ciiva.com/22685/27262-22685038.pdf?src-supplier=Element14; ComponentLink4Description: https://datasheet.ciiva.com/22685/27262-22685038.pdf?src-supplier=Element14; Supplier Part Number 1: 399-9598-1-ND
LINK1-LINK3 = QPC02SXGN-RC: 2 Position 2.54 mm Centerline Single Circuit Open Top Jumper; Manufacturer: Sullins; Supplier 1: Digi-Key; Manufacturer Part Number: QPC02SXGN-RC; RoHS: Yes; Category: Connectors; Stock 1: 813327; Pricing 1: 1=0.10000, 10=0.05000, 25=0.04080, 50=0.03780, 100=0.03650, 250=0.03152, 500=0.03024, 1000=0.02646, 2500=0.02394 (USD); ComponentLink1URL: https://datasheet.ciiva.com/767/284-sxgn-11510-767869.pdf?src-supplier=Digi-Key; ComponentLink1Description: https://datasheet.ciiva.com/767/284-sxgn-11510-767869.pdf?src-supplier=Digi-Key; Supplier Part Number 1: S9337-ND
MH1-MH3 = MH_7.4MMC_3.2MMD: Mounting Hole 7.4mm Diameter, 3.2mm Drill
MH4 = MH_7.4MM_NC_3.2MMD: Hole 7.4mm Diameter (Non Copper), 3.2mm Drill NPHT
R1 R4 R14 R18-R21 = RC0805FR-0710KL: Res Thick Film 0805 10K Ohm 1% 0.125W(1/8W) +/-100ppm/C Epoxy Pad SMD T/R; Manufacturer: Yageo; Resistance: 10kR; Temperature Coefficient: 100ppm/°C; Power Rating: 125mW; Voltage Rating: 150V; Supplier 1: Digi-Key; Manufacturer Part Number: RC0805FR-0710KL; RoHS: Yes; Category: Chip SMD Resistors; Stock 1: 10094842; Pricing 1: 1=0.10000, 10=0.03300, 100=0.01340, 1000=0.00602, 2500=0.00523 (USD); Case/Package: 0805; Case Code (Imperial): 0805; Case Code (Metric): 2012; Size Code: 0805; Min Operating Temperature: -55°C; Max Operating Temperature: 155°C; Packaging: Tape and Reel; Tolerance: 1%; Resistor Type: Thick Film; Package Quantity: 1; Termination: SMD/SMT; Number of Terminations: 2; Max Power Dissipation: 125mW; Features: Moisture Resistant; Series: RC; Construction: Rectangular; Resistance Tolerance: 1%; Technology: THICK FILM; Length: 0.079inch; Width: 0.049inch; Height: 0.024inch; Depth: 1.25mm; Lead Free: Lead Free; Military Standard: Not; RoHS Compliant: Yes; Supplier Part Number 1: 311-10.0KCRCT-ND
R2 R3 R15 R17 R22 = RC0805FR-07560RL: Res General Purpose Thick Film 0805 560 Ohm 1% 1/8W ±100ppm/°C Molded Paper T/R; Manufacturer: Yageo; Power Rating: 125mW; Voltage Rating: 150V; Supplier 1: Digi-Key; Manufacturer Part Number: RC0805FR-07560RL; RoHS: Yes; Category: Chip SMD Resistors; Stock 1: 304366; Pricing 1: 1=0.10000, 10=0.03300, 100=0.01330, 1000=0.00600, 2500=0.00520 (USD); Case/Package: 0805; Case Code (Metric): 2012; Case Code (Imperial): 0805; Weight: 0.000194oz; Size Code: 0805; Min Operating Temperature: -55°C; Max Operating Temperature: 155°C; Tolerance: 1%; Resistance: 560R; Packaging: Cut Tape; Resistor Type: Thick Film; Temperature Coefficient: 100ppm/°C; Package Quantity: 1; Number of Terminations: 2; Termination: SMD/SMT; Max Power Dissipation: 125mW; Features: Moisture Resistant; Series: RC; Resistance Tolerance: 1%; Construction: Rectangular; Length: 0.079inch; Width: 0.049inch; Height: 0.024inch; Depth: 1.25mm; Lead Free: Lead Free; RoHS Compliant: Yes; Military Standard: Not; Supplier Part Number 1: 311-560CRCT-ND
R5-R7 R13 R23-R25 = RC0805FR-0722RL: Res Thick Film 0805 22 Ohm 1% 0.125W(1/8W) ±100ppm/C Pad SMD T/R; Manufacturer: Yageo; Temperature Coefficient: 100ppm/°C; Power Rating: 125mW; Voltage Rating: 150V; Supplier 1: Digi-Key; Manufacturer Part Number: RC0805FR-0722RL; RoHS: Yes; Category: Chip SMD Resistors; Stock 1: 424246; Pricing 1: 1=0.10000, 10=0.03400, 100=0.01390, 1000=0.00624, 2500=0.00541 (USD); Case/Package: 0805; Case Code (Metric): 2012; Case Code (Imperial): 0805; Min Operating Temperature: -55°C; Max Operating Temperature: 155°C; Resistor Type: Thick Film; Resistance: 22R; Tolerance: 1%; Packaging: Tape and Reel; Package Quantity: 1; Number of Terminations: 2; Termination: SMD/SMT; Max Power Dissipation: 125mW; Working Voltage: 150V; Features: Moisture Resistant; Series: RC; Resistance Tolerance: 1%; Construction: Rectangular; Technology: THICK FILM; Length: 0.079inch; Width: 0.049inch; Height: 0.024inch; Depth: 1.25mm; Lead Free: Lead Free; RoHS Compliant: Yes; Military Standard: Not; ComponentLink1URL: https://datasheet.ciiva.com/11819/0900766b8106beab-11819837.pdf?src-supplier=Rs; ComponentLink1Description: https://datasheet.ciiva.com/11819/0900766b8106beab-11819837.pdf?src-supplier=Rs; ComponentLink2URL: https://datasheet.ciiva.com/46447/444164-46447574.pdf?src-supplier=Element14; ComponentLink2Description: https://datasheet.ciiva.com/46447/444164-46447574.pdf?src-supplier=Element14; ComponentLink3URL: https://datasheet.ciiva.com/2457/pyu-r-int-thick-7-2457045.pdf?src-supplier=Digi-Key; ComponentLink3Description: https://datasheet.ciiva.com/2457/pyu-r-int-thick-7-2457045.pdf?src-supplier=Digi-Key; ComponentLink4URL: https://datasheet.ciiva.com/2457/pyu-r-int-thick-7-2457046.pdf?src-supplier=Digi-Key; ComponentLink4Description: https://datasheet.ciiva.com/2457/pyu-r-int-thick-7-2457046.pdf?src-supplier=Digi-Key; ComponentLink5URL: https://datasheet.ciiva.com/2457/pyu-r-int-thick-7-2457044.pdf?src-supplier=Digi-Key; ComponentLink5Description: https://datasheet.ciiva.com/2457/pyu-r-int-thick-7-2457044.pdf?src-supplier=Digi-Key; ComponentLink6URL: https://datasheet.ciiva.com/12667/rc0805-12667371.pdf?src-supplier=Mouser; ComponentLink6Description: https://datasheet.ciiva.com/12667/rc0805-12667371.pdf?src-supplier=Mouser; Supplier Part Number 1: 311-22.0CRCT-ND
R8 R26-R28 = RC0805JR-070RL: Surface Mount Thick Film Resistor, RC Series, 125 mW, - 5%, 150 V, 0805 [2012 Metric]; Manufacturer: Yageo; Resistance: 0mR; Power Rating: 125mW; Voltage Rating: 150V; Temperature Coefficient: 200ppm/°C; Supplier 1: Digi-Key; Manufacturer Part Number: RC0805JR-070RL; RoHS: Yes; Category: Chip SMD Resistors; Stock 1: 4913961; Pricing 1: 1=0.10000, 10=0.02800, 25=0.02040, 50=0.01560, 100=0.01150, 250=0.00876, 500=0.00702, 1000=0.00517 (USD); Case/Package: 0805; Number of Pins: 2; Contact Plating: Tin,Matte; Case Code (Imperial): 0805; Case Code (Metric): 2012; Size Code: 0805; Min Operating Temperature: -55°C; Max Operating Temperature: 155°C; Resistor Type: Thick Film; Tolerance: 5%; Packaging: Tape and Reel; Voltage Rating (DC): 150V; Termination: SMD/SMT; Features: Moisture Resistant; Series: RC; Max Power Dissipation: 125mW; Number of Terminations: 2; Construction: Rectangular; Technology: THICK FILM; Resistance Tolerance: 5%; Length: 2mm; Width: 1.25mm; Height: 0.5mm; Depth: 1.25mm; Radiation Hardening: No; RoHS Compliant: Yes; Military Standard: Not; Lead Free: Lead Free; ComponentLink1URL: https://datasheet.ciiva.com/7941/1738694-7941861.pdf?src-supplier=Element14; ComponentLink1Description: https://datasheet.ciiva.com/7941/1738694-7941861.pdf?src-supplier=Element14; ComponentLink2URL: https://datasheet.ciiva.com/11819/0900766b8106beab-11819430.pdf?src-supplier=Rs; ComponentLink2Description: https://datasheet.ciiva.com/11819/0900766b8106beab-11819430.pdf?src-supplier=Rs; ComponentLink3URL: https://datasheet.ciiva.com/7941/1738694-7941862.pdf?src-supplier=Element14; ComponentLink3Description: https://datasheet.ciiva.com/7941/1738694-7941862.pdf?src-supplier=Element14; ComponentLink4URL: https://datasheet.ciiva.com/7941/1738694-7941863.pdf?src-supplier=Element14; ComponentLink4Description: https://datasheet.ciiva.com/7941/1738694-7941863.pdf?src-supplier=Element14; ComponentLink5URL: https://datasheet.ciiva.com/15190/getdatasheetpartid-330685-15190028.pdf?src-supplier=Verical; ComponentLink5Description: https://datasheet.ciiva.com/15190/getdatasheetpartid-330685-15190028.pdf?src-supplier=Verical; Supplier Part Number 1: 311-0.0ARCT-ND
R9 R16 = RC0805FR-071ML: Res Thick Film 0805 1M Ohm 1% 0.125W(1/8W) ±100ppm/C Pad SMD T/R; Manufacturer: Yageo; Resistance: 1MR; Power Rating: 125mW; Temperature Coefficient: 250ppm/°C; Voltage Rating: 150V; Supplier 1: Digi-Key; Manufacturer Part Number: RC0805FR-071ML; RoHS: Yes; Category: Chip SMD Resistors; Stock 1: 1714811; Pricing 1: 1=0.10000, 10=0.03300, 100=0.01330, 1000=0.00600, 2500=0.00520 (USD); Case/Package: Molded; Case Code (Metric): 2012; Case Code (Imperial): 0805; Size Code: 0805; Min Operating Temperature: -55°C; Max Operating Temperature: 155°C; Resistor Type: Thick Film; Tolerance: 1%; Packaging: Tape and Reel; Package Quantity: 1; Number of Terminations: 2; Termination: SMD/SMT; Max Power Dissipation: 125mW; Features: Moisture Resistant; Series: RC; Construction: Rectangular; Resistance Tolerance: 1%; Length: 2mm; Width: 0.049inch; Height: 0.024inch; Depth: 1.25mm; Lead Free: Lead Free; RoHS Compliant: Yes; Military Standard: Not; Supplier Part Number 1: 311-1.00MCRCT-ND
R10-R12 = RC0805FR-071KL: RES SMD 1K OHM 1% 1/8W 0805; Manufacturer: Yageo; Resistance: 1kR; Temperature Coefficient: 100ppm/°C; Voltage Rating (DC): 150V; Power Rating: 125mW; Supplier 1: Digi-Key; Manufacturer Part Number: RC0805FR-071KL; RoHS: Yes; Category: Chip SMD Resistors; Stock 1: 8515767; Pricing 1: 1=0.10000, 10=0.03300, 100=0.01330, 1000=0.00600, 2500=0.00520 (USD); Case/Package: 0805; Number of Pins: 2; Case Code (Metric): 2012; Case Code (Imperial): 0805; Size Code: 0805; Min Operating Temperature: -55°C; Max Operating Temperature: 155°C; Tolerance: 1%; Packaging: Tape and Reel; Resistor Type: Thick Film; Package Quantity: 1; Voltage Rating: 150V; Number of Terminations: 2; Termination: SMD/SMT; Max Power Dissipation: 125mW; Features: Moisture Resistant; Series: RC; Resistance Tolerance: 1%; Construction: Rectangular; Length: 0.079inch; Width: 0.049inch; Height: 0.024inch; Depth: 1.25mm; Reach SVHC Compliant: Yes; Lead Free: Lead Free; RoHS Compliant: Yes; Military Standard: Not; ComponentLink1URL: https://datasheet.ciiva.com/7941/1686128-7941719.pdf?src-supplier=Element14; ComponentLink1Description: https://datasheet.ciiva.com/7941/1686128-7941719.pdf?src-supplier=Element14; ComponentLink2URL: https://datasheet.ciiva.com/46385/444164-46385020.pdf?src-supplier=Element14; ComponentLink2Description: https://datasheet.ciiva.com/46385/444164-46385020.pdf?src-supplier=Element14; ComponentLink3URL: https://datasheet.ciiva.com/2456/pyu-r-int-thick-7-2456976.pdf?src-supplier=Digi-Key; ComponentLink3Description: https://datasheet.ciiva.com/2456/pyu-r-int-thick-7-2456976.pdf?src-supplier=Digi-Key; ComponentLink4URL: https://datasheet.ciiva.com/2456/pyu-r-int-thick-7-2456977.pdf?src-supplier=Digi-Key; ComponentLink4Description: https://datasheet.ciiva.com/2456/pyu-r-int-thick-7-2456977.pdf?src-supplier=Digi-Key; ComponentLink5URL: https://datasheet.ciiva.com/2456/pyu-r-int-thick-7-2456975.pdf?src-supplier=Digi-Key; ComponentLink5Description: https://datasheet.ciiva.com/2456/pyu-r-int-thick-7-2456975.pdf?src-supplier=Digi-Key; ComponentLink6URL: https://datasheet.ciiva.com/16850/rc0805-16850409.pdf?src-supplier=Future+Electronics; ComponentLink6Description: https://datasheet.ciiva.com/16850/rc0805-16850409.pdf?src-supplier=Future+Electronics; Supplier Part Number 1: 311-1.00KCRCT-ND